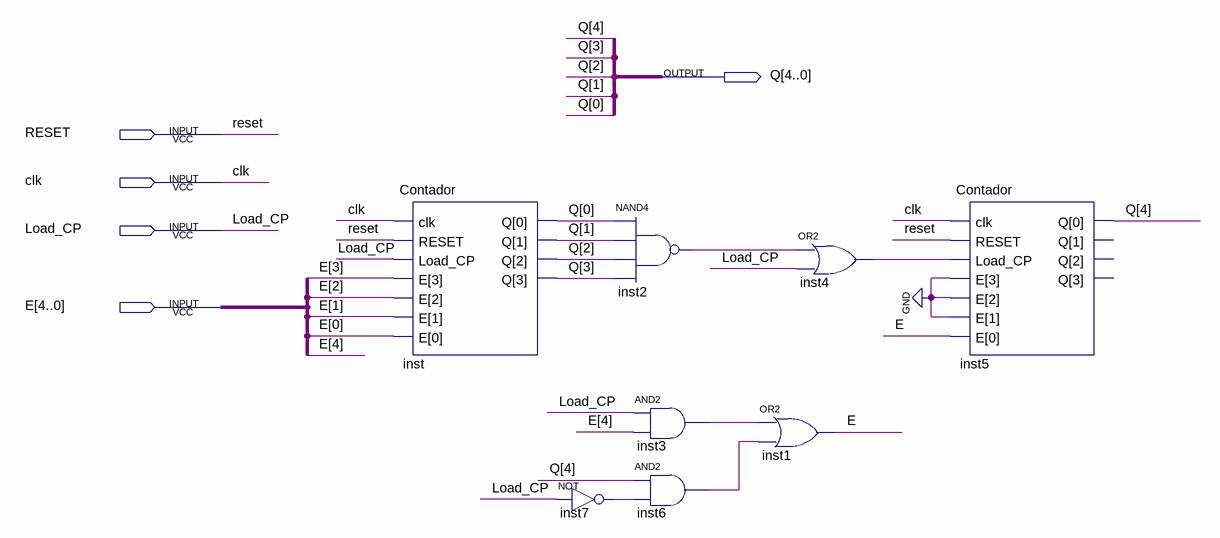
[diagram p0: schematic sheet]
// Quartus schematic ContadorCascata.bdf as structural Verilog: 8 symbols, 5 pins
module ContadorCascata (
  input  RESET,
  input  clk,
  input  Load_CP,
  input  [4:0] E,
  output [4:0] Q
);

  wire E_1bit, inst2_out, inst3_out, inst4_out, inst6_out, inst7_out;
  wire [3:0] inst5_q_open;  // unused outputs

  Contador inst (.clk(clk), .RESET(RESET), .Load_CP(Load_CP), .E(E[3:0]), .Q(Q[3:0]));
  not inst7 (inst7_out, Load_CP);
  nand inst2 (inst2_out, Q[0], Q[1], Q[2], Q[3]);
  and inst3 (inst3_out, Load_CP, E[4]);
  and inst6 (inst6_out, Q[4], inst7_out);
  or inst4 (inst4_out, inst2_out, Load_CP);
  or inst1 (E_1bit, inst3_out, inst6_out);
  Contador inst5 (.clk(clk), .RESET(RESET), .Load_CP(inst4_out), .E({3'b000, E_1bit}), .Q({inst5_q_open[3:1], Q[4]}));
endmodule
